# EAGLE design Mini_Arduino_5mm (EAGLE 6.5.0)
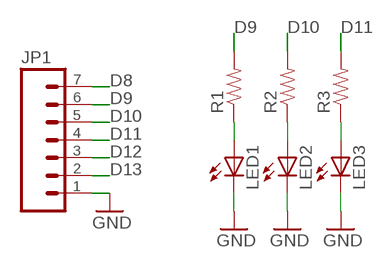
[diagram p0: schematic, sheet 1]

## Parts
JP1  M07  [1X07]
LED1  LED5MM  [LED5MM]
LED2  LED5MM  [LED5MM]
LED3  LED5MM  [LED5MM]
R1  RESISTORAXIAL-0.3  [AXIAL-0.3]
R2  RESISTORAXIAL-0.3  [AXIAL-0.3]
R3  RESISTORAXIAL-0.3  [AXIAL-0.3]

## Nets
D8: JP1.7
D9: JP1.6 R1.P$2
D10: JP1.5 R2.P$2
D11: JP1.4 R3.P$2
D12: JP1.3
D13: JP1.2
GND: JP1.1 LED1.K(C) LED2.K(C) LED3.K(C)
N$1: LED1.A R1.P$1
N$3: LED2.A R2.P$1
N$5: LED3.A R3.P$1

## Library data of the parts
JP1 = SparkFun-Connectors:M07: Header 7 Standard 7-pin 0.1" header. Use with straight break away headers (SKU : PRT-00116), right angle break away headers (PRT-00553), swiss pins (PRT-00743), machine pins (PRT-00117), and female headers (PRT-00115). NOTES ON THE VARIANTS LOCK and LOCK_LONGPADS... This footprint was designed to help hold the alignment of a through-hole component (i.e. 7-pin header) while soldering it into place. You may notice that each hole has been shifted either up or down by 0.005 of an inch from it's more standard position (which is usually a perfectly straight line). This slight alteration caused the pins (the squares in the middle) to touch the edges of the holes. Because they are alternating, it causes a "brace" to hold the header in place. 0.005 has proven to be the perfect amount of "off-center" position when using our standard breakaway headers. Although looks a little odd when you look at the bare footprint, once you have a header in there, the alteration is very hard to notice. Also, if you push a header all the way into place, it is covered up entirely on the bottom side. This idea of altering the position of holes to aid alignment will be further integrated into the Sparkfun Library for other footprints. It can help hold any component with 3 or more connection pins.
LED1-LED3 = barbary_enterprises:LED: LEDs Standard schematic elements and footprints for 5mm, 3mm, 1206, and 0603 sized LEDs. 5mm - Spark Fun Electronics SKU : COM-00529 (and others)
R1-R3 = barbary_enterprises:RESISTOR: Resistor Basic schematic elements and footprints for 0603, 1206, and PTH resistors.

## Board
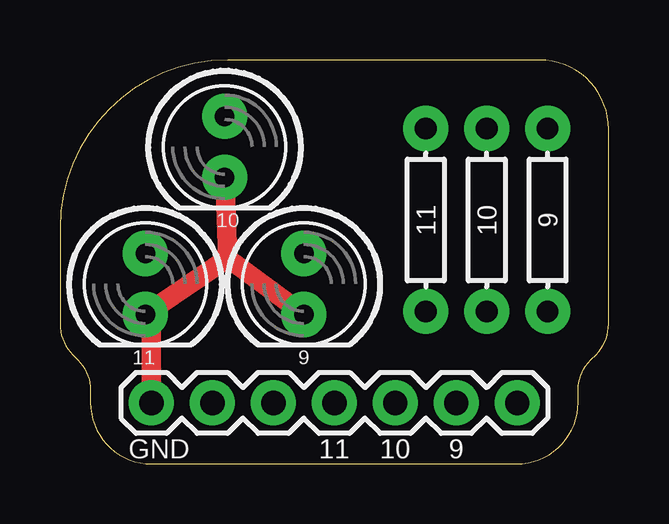
[diagram p1: board, top side]
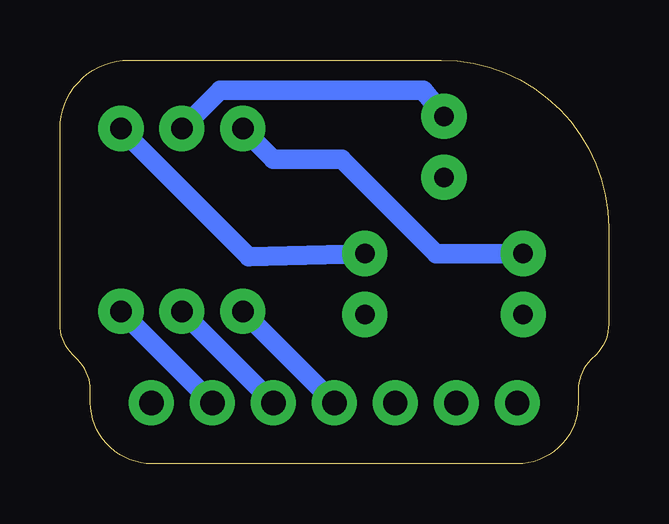
[diagram p2: board, bottom side, seen from below]

Size 22.86 x 16.83 mm. Coordinates in mm from the lower left corner, seen from the top.
Outline: 21.59,2.56 21.59,3.07 arc-45 22.12,4.34 22.33,4.55 arc45 22.86,5.82 22.86,13.95 arc90 19.98,16.83 6.98,16.82 arc90 0,9.84 0,5.82 arc45 0.53,4.55 0.74,4.34 arc-45 1.27,3.07 1.27,2.54 arc90 3.81,0 19.03,0 arc90 21.59,2.56
Copper layers (1*16): Top 0.035mm / dielectric 1.5mm / Bottom 0.035mm
Design rules "default": minimum track width 10mil, minimum drill 24mil, track to track 8mil, track to pad 8mil, pad to pad 8mil, via to via 8mil, smd to smd 8mil, copper to edge 40mil, drill to drill 8mil, minimum pad ring 10mil, minimum via ring 8mil, stop-mask expansion 4mil, vias tented up to drill 0mil, thermal gap 10mil

### Footprints (pad centres in the part's own frame; a part is rotated, then mirrored left to right if it is on the bottom)
1X07 = drill 1.016 pad 1.88: 1 0,0; 2 2.54,0; 3 5.08,0; 4 7.62,0; 5 10.16,0; 6 12.7,0; 7 15.24,0
LED5MM = drill 0.813 pad 1.88: A -1.27,0; K 1.27,0
AXIAL-0.3 = drill 0.9 pad 1.88: P$1 -3.81,0; P$2 3.81,0

### Placement (x,y rotation side)
JP1  3.81,2.54 0 top
LED1  10.16,7.49 270 top
LED2  6.86,13.21 270 top
LED3  3.56,7.49 270 top
R1  20.32,10.16 270 top
R2  17.78,10.16 270 top
R3  15.24,10.16 270 top

### Tracks (layer width: path | path; a pad name or v marks a point on that pad's centre or on a via)
D9
  Bottom 0.813: JP1.6 R1.P$2
D10
  Bottom 0.813: JP1.5 R2.P$2
D11
  Bottom 0.813: JP1.4 R3.P$2
GND
  Top 0.813: JP1.1 3.81,5.97 LED3.K 6.99,8.57 | 6.99,8.57 LED1.K | LED2.K 6.99,8.57
N$1
  Bottom 0.813: R1.P$1 14.99,8.64 LED1.A
N$3
  Bottom 0.813: R2.P$1 16.19,15.56 7.73,15.56 LED2.A
N$5
  Bottom 0.813: LED3.A 7.18,8.76 11.11,12.7 13.97,12.7 R3.P$1

### Text on the board
tPlace: 10 | 11 | 10 | 9 | 11 | 9 | GND | 11 | 10 | 9